# Altium schematic sheet Receiver.SchDoc
size A4
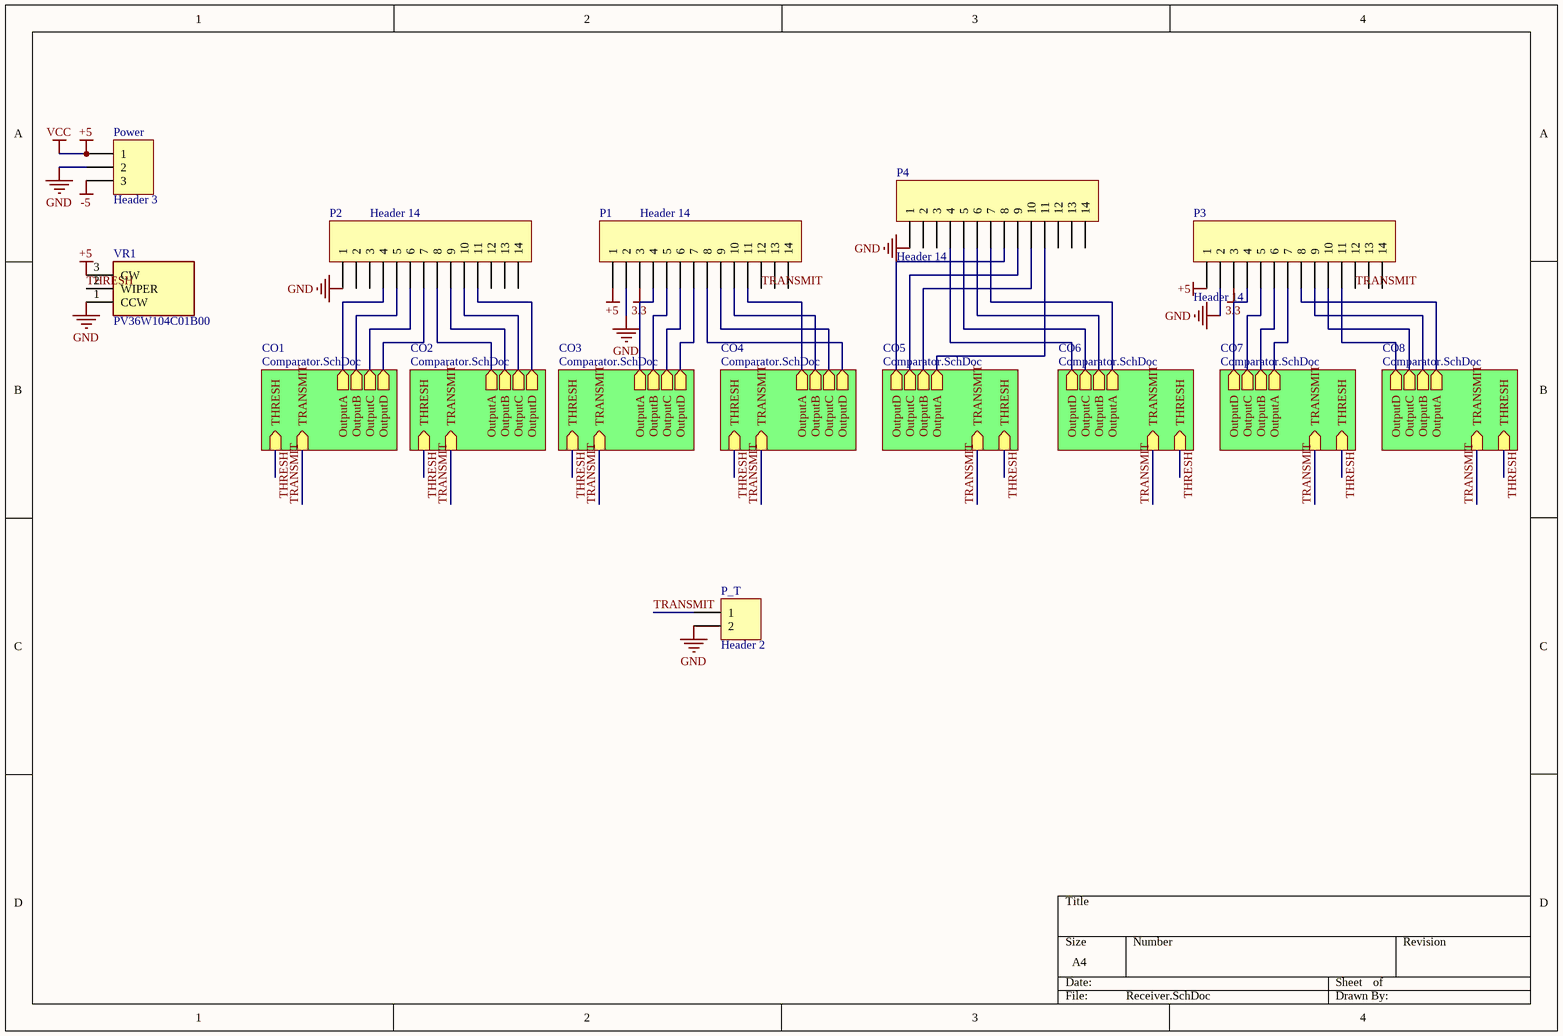
[diagram p0: Receiver.SchDoc]

## Parts
P1  Header 14  [HDR1X14]
P2  Header 14  [HDR1X14]
P3  Header 14  [HDR1X14]
P4  Header 14  [HDR1X14]
P_T  Header 2  [HDR1X2]
Power  Header 3  [HDR1X3]
VR1  PV36W104C01B00  [PV36W]

## Sub-sheets
CO1 = Comparator.SchDoc: THRESH (in), OutputD (out), OutputC (out), OutputB (out), OutputA (out), TRANSMIT (in)
CO2 = Comparator.SchDoc: THRESH (in), OutputD (out), OutputC (out), OutputB (out), OutputA (out), TRANSMIT (in)
CO3 = Comparator.SchDoc: THRESH (in), OutputD (out), OutputC (out), OutputB (out), OutputA (out), TRANSMIT (in)
CO4 = Comparator.SchDoc: THRESH (in), OutputD (out), OutputC (out), OutputB (out), OutputA (out), TRANSMIT (in)
CO5 = Comparator.SchDoc: THRESH (in), OutputD (out), OutputC (out), OutputB (out), OutputA (out), TRANSMIT (in)
CO6 = Comparator.SchDoc: THRESH (in), OutputD (out), OutputC (out), OutputB (out), OutputA (out), TRANSMIT (in)
CO7 = Comparator.SchDoc: THRESH (in), OutputD (out), OutputC (out), OutputB (out), OutputA (out), TRANSMIT (in)
CO8 = Comparator.SchDoc: THRESH (in), OutputD (out), OutputC (out), OutputB (out), OutputA (out), TRANSMIT (in)

## Nets
3.3: P1.3 P3.3
+5: P1.1 P3.1 Power.1 VR1.3(CW)  [also labelled VCC]
-5: Power.3
GND: P1.2 P2.1 P3.2 P4.1 P_T.2 Power.2 VR1.1(CCW)
THRESH: VR1.2(WIPER) ; sheet CO1/THRESH, sheet CO2/THRESH, sheet CO3/THRESH, sheet CO4/THRESH, sheet CO5/THRESH, sheet CO6/THRESH, sheet CO7/THRESH, sheet CO8/THRESH
TRANSMIT: P1.12 P3.12 P_T.1 ; sheet CO1/TRANSMIT, sheet CO2/TRANSMIT, sheet CO3/TRANSMIT, sheet CO4/TRANSMIT, sheet CO5/TRANSMIT, sheet CO6/TRANSMIT, sheet CO7/TRANSMIT, sheet CO8/TRANSMIT
NetP1_4: P1.4 ; sheet CO3/OutputA
NetP1_5: P1.5 ; sheet CO3/OutputB
NetP1_6: P1.6 ; sheet CO3/OutputC
NetP1_7: P1.7 ; sheet CO3/OutputD
NetP1_8: P1.8 ; sheet CO4/OutputD
NetP1_9: P1.9 ; sheet CO4/OutputC
NetP1_10: P1.10 ; sheet CO4/OutputB
NetP1_11: P1.11 ; sheet CO4/OutputA
NetP2_4: P2.4 ; sheet CO1/OutputA
NetP2_5: P2.5 ; sheet CO1/OutputB
NetP2_6: P2.6 ; sheet CO1/OutputC
NetP2_7: P2.7 ; sheet CO1/OutputD
NetP2_8: P2.8 ; sheet CO2/OutputA
NetP2_9: P2.9 ; sheet CO2/OutputB
NetP2_10: P2.10 ; sheet CO2/OutputC
NetP2_11: P2.11 ; sheet CO2/OutputD
NetP3_4: P3.4 ; sheet CO7/OutputD
NetP3_5: P3.5 ; sheet CO7/OutputC
NetP3_6: P3.6 ; sheet CO7/OutputB
NetP3_7: P3.7 ; sheet CO7/OutputA
NetP3_8: P3.8 ; sheet CO8/OutputA
NetP3_9: P3.9 ; sheet CO8/OutputB
NetP3_10: P3.10 ; sheet CO8/OutputC
NetP3_11: P3.11 ; sheet CO8/OutputD
NetP4_4: P4.4 ; sheet CO6/OutputD
NetP4_5: P4.5 ; sheet CO6/OutputC
NetP4_6: P4.6 ; sheet CO6/OutputB
NetP4_7: P4.7 ; sheet CO6/OutputA
NetP4_8: P4.8 ; sheet CO5/OutputD
NetP4_9: P4.9 ; sheet CO5/OutputC
NetP4_10: P4.10 ; sheet CO5/OutputB
NetP4_11: P4.11 ; sheet CO5/OutputA

Not connected (* = marked no-connect by the designer): P1 13 14; P2 2 3 12 13 14; P3 13 14; P4 2 3 12 13 14

## Library data of the parts
P1-P4 = Header 14: Header, 14-Pin; LatestRevisionDate: 17-Jul-2002; LatestRevisionNote: Re-released for DXP Platform.; Publisher: Altium Limited
P_T = Header 2: Header, 2-Pin; LatestRevisionDate: 17-Jul-2002; LatestRevisionNote: Re-released for DXP Platform.; Publisher: Altium Limited
Power = Header 3: Header, 3-Pin; LatestRevisionDate: 17-Jul-2002; LatestRevisionNote: Re-released for DXP Platform.; Publisher: Altium Limited
VR1 = PV36W104C01B00: Variable Resistor; Manufacturer_Name: Bourns; Allied_Number: 71024705; Datasheet Link: https://www.bourns.com/docs/Product-Datasheets/pv36.pdf; Manufacturer_Part_Number: PV36W104C01B00; Mouser Part Number: 81-PV36W104C01B00; Mouser Price/Stock: https://www.mouser.com/Search/Refine.aspx?Keyword=81-PV36W104C01B00; RS Part Number: 7692160P; RS Price/Stock: http://uk.rs-online.com/web/p/products/7692160P; Allied Price/Stock: https://www.alliedelec.com/bourns-pv36w104c01b00/71024705/